# Altium schematic sheet SCH.schdoc
size 182 x 154 mm
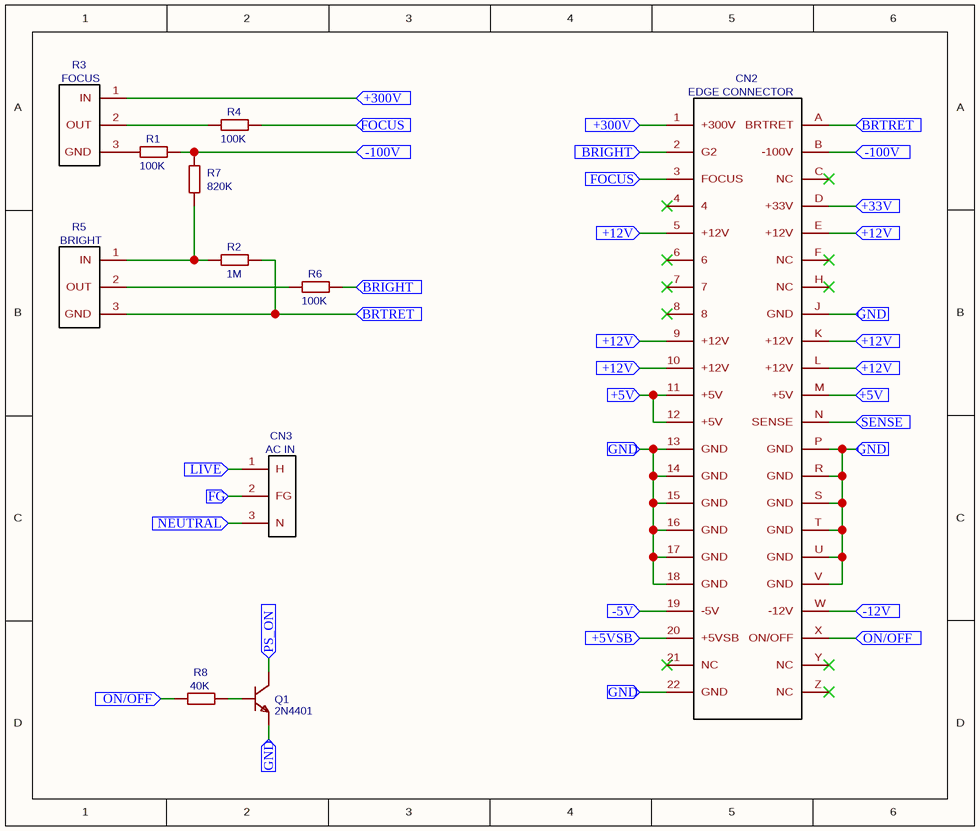
[diagram p0: SCH.schdoc]

## Parts
CN2  EDGE CONNECTOR  [LISA_PSU_EDGE_CONNECTOR]
CN3  AC IN  [LISA_PSU_AC_IN]
Q1  2N4401  [TO-92-3_L4.9-W3.7-P1.27-L]
R1  100K  [LISA_RESISTOR]
R2  1M  [LISA_RESISTOR]
R3  FOCUS  [LISA_CRT_POT]
R4  100K  [LISA_RESISTOR]
R5  BRIGHT  [LISA_CRT_POT]
R6  100K  [LISA_RESISTOR]
R7  820K  [LISA_RESISTOR]
R8  40K  [LISA_RESISTOR]

## Ports
+5V (in), +5VSB (in), +12V (in), +33V (in), +300V (in), -5V (in), -12V (in), -100V (in), BRIGHT (in), BRTRET (in), FG (in), FOCUS (in), GND (in), LIVE (in), NEUTRAL (in), ON/OFF (in), PS_ON (in), SENSE (in)

## Nets
+5V: CN2.11(+5V) CN2.12(+5V) CN2.M(+5V) ; port +5V
+5VSB: CN2.20(+5VSB) ; port +5VSB
+12V: CN2.5(+12V) CN2.9(+12V) CN2.10(+12V) CN2.E(+12V) CN2.K(+12V) CN2.L(+12V) ; port +12V
+33V: CN2.D(+33V) ; port +33V
+300V: CN2.1(+300V) R3.1(IN) ; port +300V
-5V: CN2.19(-5V) ; port -5V
-12V: CN2.W(-12V) ; port -12V
-100V: CN2.B(-100V) R1.2 R7.1 ; port -100V
BRIGHT: CN2.2(G2) R6.1 ; port BRIGHT
BRTRET: CN2.A(BRTRET) R2.1 R5.3(GND) ; port BRTRET
FG: CN3.2(FG) ; port FG
FOCUS: CN2.3(FOCUS) R4.1 ; port FOCUS
GND: CN2.13(GND) CN2.14(GND) CN2.15(GND) CN2.16(GND) CN2.17(GND) CN2.18(GND) CN2.22(GND) CN2.J(GND) CN2.P(GND) CN2.R(GND) CN2.S(GND) CN2.T(GND) CN2.U(GND) CN2.V(GND) Q1.1(E) ; port GND
LIVE: CN3.1(H) ; port LIVE
NEUTRAL: CN3.3(N) ; port NEUTRAL
ON/OFF: CN2.X(ON/OFF) R8.1 ; port ON/OFF
PS_ON: Q1.3(C) ; port PS_ON
SENSE: CN2.N(SENSE) ; port SENSE
NetQ1_2: Q1.2(B) R8.2
NetR1_1: R1.1 R3.3(GND)
NetR2_2: R2.2 R5.1(IN) R7.2
NetR3_2: R3.2(OUT) R4.2
NetR5_2: R5.2(OUT) R6.2

Not connected (* = marked no-connect by the designer): CN2 4* 6* 7* 8* 21(NC)* C(NC)* F(NC)* H(NC)* Y(NC)* Z(NC)*

## Library data of the parts
CN2 = EDGE CONNECTOR: Contributor: will_tooker; spicePre: C; spiceSymbolName: LISA_PSU_EDGE_CONNECTOR
CN3 = AC IN: Contributor: William Tooker; spicePre: C; spiceSymbolName: LISA_PSU_AC_IN
Q1 = 2N4401: BOM_Manufacturer: ST(先科); Contributor: 立创EDA官方封装库; BOM_Supplier: LCSC; BOM_Manufacturer Part: 2N4401; BOM_Supplier Part: C118540; BOM_JLCPCB Part Class: Extended Part; spicePre: Q; spiceSymbolName: 2N4401-C118540
R1 R4 R6 = 100K: Contributor: William Tooker; spicePre: R; spiceSymbolName: LISA_CPU_RESISTOR
R2 = 1M: Contributor: William Tooker; spicePre: R; spiceSymbolName: LISA_CPU_RESISTOR
R3 = FOCUS: Contributor: William Tooker; spicePre: R; spiceSymbolName: LISA_CRT_POT
R5 = BRIGHT: Contributor: William Tooker; spicePre: R; spiceSymbolName: LISA_CRT_POT
R7 = 820K: Contributor: William Tooker; spicePre: R; spiceSymbolName: LISA_CPU_RESISTOR
R8 = 40K: Contributor: William Tooker; spicePre: R; spiceSymbolName: LISA_CPU_RESISTOR